# EAGLE schematic Colour Detector (EAGLE 9.6.2)
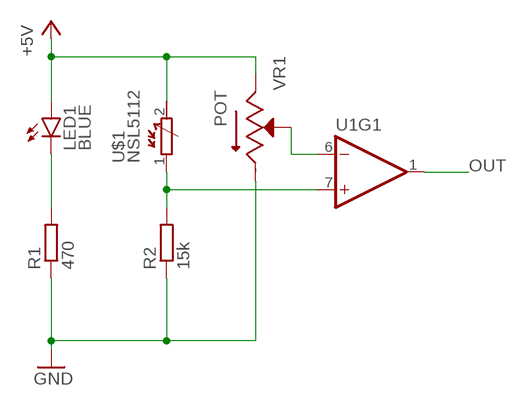
[diagram p0: schematic, sheet 1]

## Parts
LED1  BLUE  LED_23MM  [LED3MM]
R1  470  R-EU_0204/7  [0204/7]
R2  15k  R-EU_0204/7  [0204/7]
U1  LM339DIP  [DIL14]
U$1  NSL5112  [KK-156-2]
VR1  POT  [TRIM_3296W-1-250]

## Nets
+5V: LED1.A U$1.2(E) VR1.1(CCW)
GND: R1.1 R2.1 VR1.3(CW)
N$1: LED1.K(C) R1.2
N$2: R2.2 U1.7(+IN) U$1.1(A)
N$3: U1.6(-IN) VR1.2(WIPER)
OUT: U1.1(OUT)
Unconnected: U1.2(OUT) U1.3(P$V+) U1.4(-IN) U1.5(+IN) U1.8(-IN) U1.9(+IN) U1.10(-IN) U1.11(+IN) U1.12(P$V-) U1.13(OUT) U1.14(OUT)

## Library data of the parts
LED1 = IDP_library:LED_2: LED
R1 R2 = IDP_library:R-EU_: RESISTOR, European symbol; SPICEPREFIX: R
U1 = IDP_library:LM339: Quad Comparator - LM339PWR Based on information from the SLCS006N datasheet from TI (www.ti.com). Created by nick@scantool.net, 2008. Updated 2016. SparkFun Products SparkFun OBD-II UART <https://www.sparkfun.com/products/9555> (WIG-09555) SparkFun Car Diagnostics Kit <https://www.sparkfun.com/products/10769> (RTL-10769)
U$1 = IDP_library:NSL5112
VR1 = IDP_library:POT: Res Cermet Trimmer 500K Ohm 10% 0.5W 25(Elec)Turn 2.19mm (9.53 X 4.83 X 11.55mm) Pin Thru-Hole Tube; AVAILABILITY: Unavailable; DESCRIPTION: Trimpot 25 Ohm 3/8 Sq Cer Mt; MF: Bourns; MP: 3296W-1-250; PACKAGE: SOT-23-5 Bourns; PRICE: None